# Altium schematic sheet 电路图节点.SchDoc
size A4
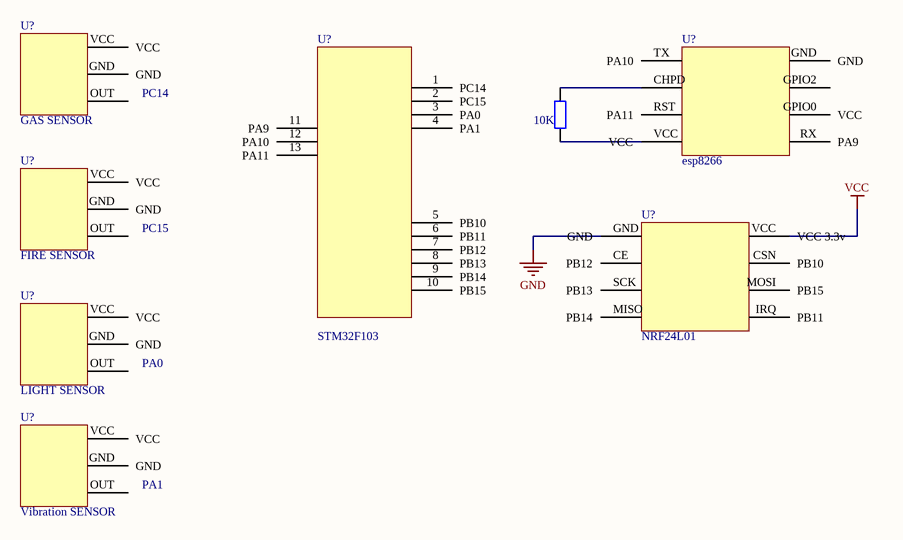
[diagram p0: 电路图节点.SchDoc]

## Parts
(Parts that share a designator on the sheet are numbered #1, #2 ... from top to bottom, then left to right.)
?  value 10K  [AXIAL-0.4]
U?#1  GAS SENSOR
U?#2  STM32F103
U?#3  esp8266
U?#4  FIRE SENSOR
U?#5  NRF24L01
U?#6  LIGHT SENSOR
U?#7  Vibration SENSOR

## Nets

Not connected (* = marked no-connect by the designer): ? 1 2; U?#1 GND OUT VCC; U?#2 1(PC14) 2(PC15) 3(PA0) 4(PA1) 5(PB10) 6(PB11) 7(PB12) 8(PB13) 9(PB14) 10(PB15) 11(PA9) 12(PA10) 13(PA11); U?#3 CHPD GND GPIO0(VCC) GPIO2 RST(PA11) RX(PA9) TX(PA10) VCC; U?#4 GND OUT VCC; U?#5 CE(PB12) CSN(PB10) GND IRQ(PB11) MISO(PB14) MOSI(PB15) SCK(PB13) VCC(VCC_3.3v); U?#6 GND OUT VCC; U?#7 GND OUT VCC

## Notes on the sheet
- (near U?#1) PC14
- (near U?#4) PC15
- (near U?#6) PA0
- (near U?#7) PA1

## Library data of the parts
? = Res2: Resistor; Published: 8-Jun-2000; LatestRevisionDate: 17-Jul-2002; LatestRevisionNote: Re-released for DXP Platform.; PackageReference: AXIAL-0.4; Publisher: Altium Limited; PackageDescription: Axial Device, Thru-Hole; 2 Leads; 0.4 in Pin Spacing
U?#1 U?#4 U?#6 U?#7 = SENSOR